# Altium schematic sheet Digital IO Connector.SchDoc
size 297 x 209 mm; CompanyName: Sainsbury Wellcome Centre; Organization: FabLab; Address1: Sainsbury Wellcome Centre; Address2: 25 Howland Street; Address3: London; Address4: W1T 4JG; DocumentNumber: 8; SheetNumber: 8; SheetTotal: 12; swcgroup: FabLab; Org: Sainsbury Wellcome Centre; Add1: 25 Howland Street; Add2: London; Add3: W1T 4JG; WebAddress: www.sainsburywellcome.org; SheetSize: A4; SheetName: Analog Input A
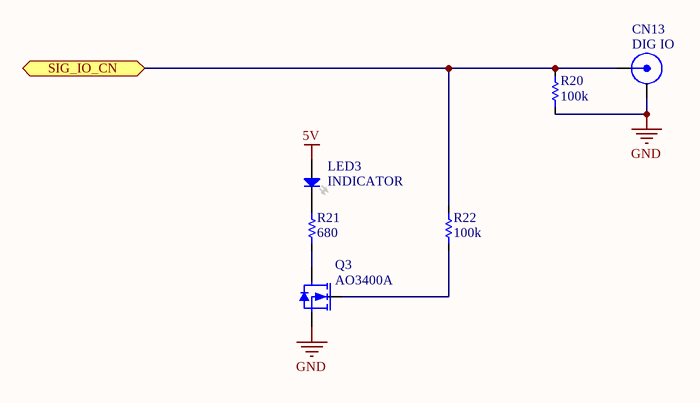
[diagram p0: Digital IO Connector.SchDoc]

## Parts
CN13  DIG IO  [BNC-AMP-112515]
LED3  INDICATOR  [LED_CHIP_0805]
Q3  AO3400A  [SOT23]
R20  value 100k  [RES_CHIP_0603]  (hidden comment: R0603-100K)
R21  value 680  [RES_CHIP_0603]  (hidden comment: R0603-680R)
R22  value 100k  [RES_CHIP_0603]  (hidden comment: R0603-100K)

## Ports
SIG_IO_CN (bidir)

## Nets
5V: LED3.2(A)
GND: CN13.2(GND) Q3.2(S) R20.1
SIG_IO_CN: CN13.1(SIG) R20.2 R22.2 ; port SIG_IO_CN
NetLED3_1: LED3.1(K) R21.2
NetQ3_1: Q3.1(G) R22.1
NetQ3_3: Q3.3(D) R21.1

## Notes on the sheet
- FILE
- VARIANT
- DATE
- REVISION
- SHEET
- /
- PROJECT
- SIZE

## Library data of the parts
CN13 = CMP-730-0003-11: RF BNC Connector, Female, Board Mount, Solder Terminal, Jack; PartNumber: 112515; Clock Frequency: 4GHz; Characteristic Impedance: 50R; LCSC Part N.: C3176191; Orientation: Straight; Connector Type: BNC; Gender: Female
LED3 = CMP-520-0018-2: White 0805 Light Emitting Diodes (LED) ROHS; PartNumber: KT-0805W; Forward Current: 25mA; Wavelength: 405nm; Pick&PlaceFootprint: LED0805; Forward Voltage: 2.9V; Colour: White; LCSC Part N.: C34499; Mount: Surface Mount
Q3 = CMP-810-0002-2: 30V 5.7A 26.5mΩ@10V,5.7A 1.4W 1.5V@250uA 1 NChannel SOT-23-3L MOSFETs; Gate-Source Voltage (Vgs): 12V; Pick&PlaceFootprint: SOT-23; RDS(ON): 26.5mR; Switching Time: 34.5ns; LCSC Part N.: C20917; Drain-Source Voltage (Vds): 30V; Mount: Surface Mount; PartNumber: AO3400A; Power Dissipation: 1.4W; Drain Current (Id): 5.7A; Polarity: N Channel
R20 R22 = CMP-633-0000-28: 100mW Thick Film Resistors 75V ±100ppm/℃ ±1% 0603 Chip Resistor; PartNumber: 0603WAF1003T5E; Number of Resistors: 1; Pick&PlaceFootprint: R0603; LCSC Part N.: C25803; Mount: Surface Mount; Voltage Rating: 75V; Power Rating: 100mW; Case/Package: 0603; Tolerance: 1%
R21 = CMP-633-0087-12: 100mW Thick Film Resistors 75V ±100ppm/℃ ±1% 0603 Chip Resistor; PartNumber: 0603WAF6800T5E; Number of Resistors: 1; Pick&PlaceFootprint: R0603; Voltage Rating: 75V; Case/Package: 0603; Power Rating: 100mW; Tolerance: 1%; Mount: Surface Mount; LCSC Part N.: C23228